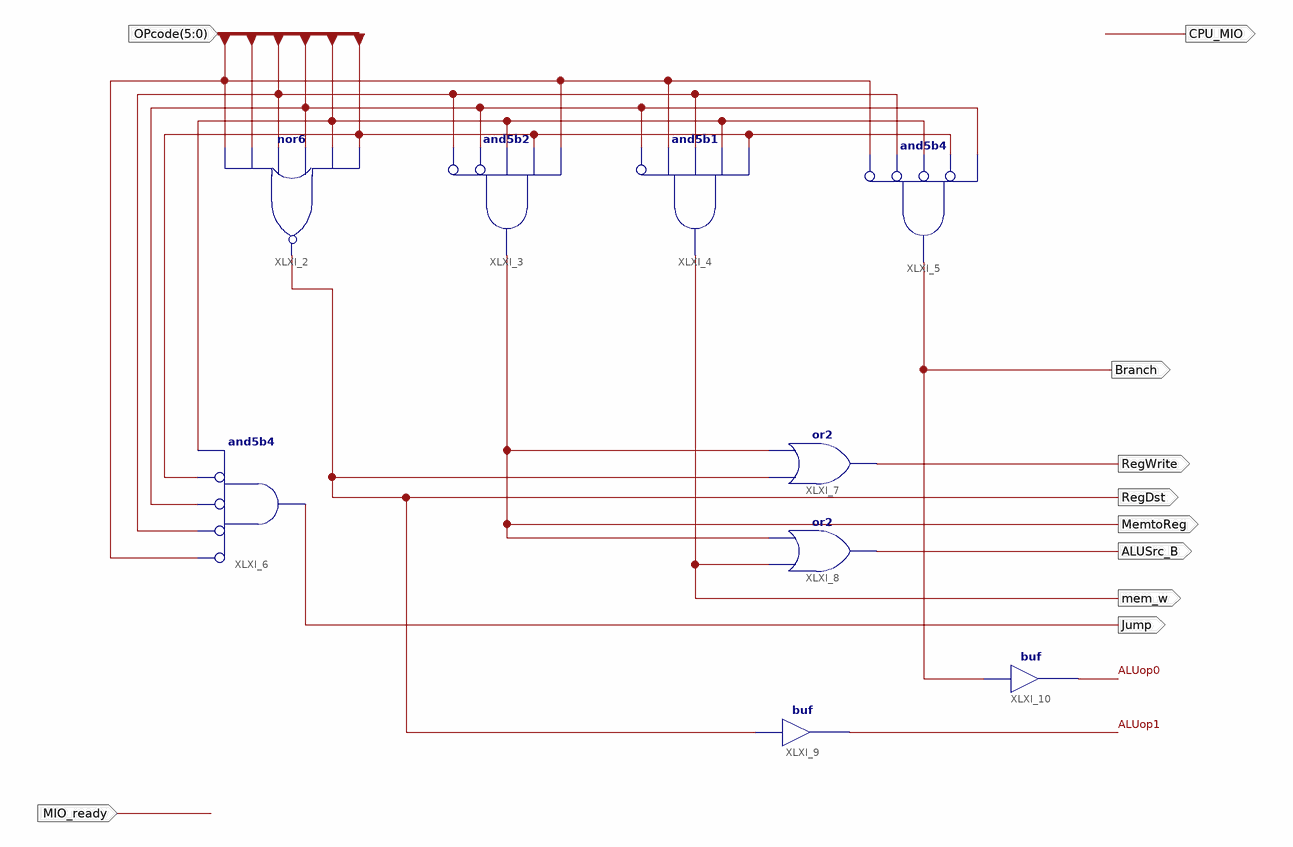
[diagram p0: schematic sheet 1]
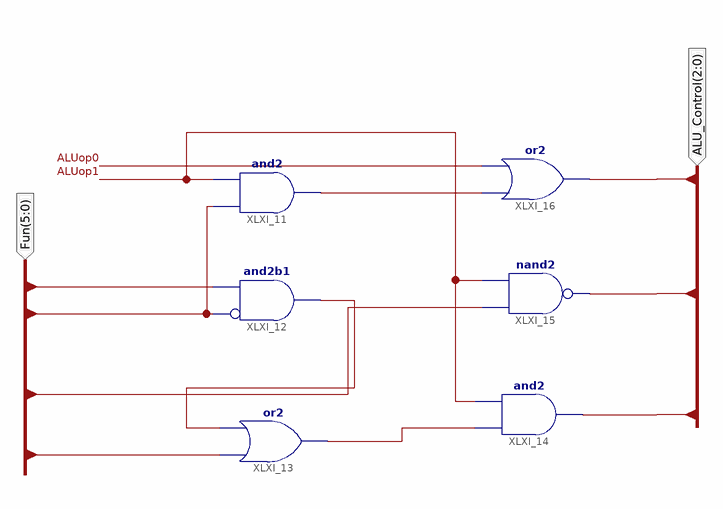
[diagram p1: schematic sheet 2]
// Xilinx ISE schematic SCPU_ctrl.sch (kintex7) as structural Verilog: 15 symbols, 12 ports
module SCPU_ctrl (
  input  [5:0] OPcode,
  input  MIO_ready,
  input  [5:0] Fun,
  input  [2:0] ALU_Control,
  output MemtoReg,
  output mem_w,
  output Jump,
  output RegDst,
  output Branch,
  output ALUSrc_B,
  output RegWrite,
  output CPU_MIO
);

  wire ALUop0, ALUop1, XLXN_49, XLXN_53, XLXN_57;

  nor XLXI_2 (RegDst, OPcode[5], OPcode[4], OPcode[3], OPcode[2], OPcode[1], OPcode[0]);
  and XLXI_3 (MemtoReg, ~OPcode[3], ~OPcode[2], OPcode[1], OPcode[0], OPcode[5]);  // and5b2
  and XLXI_4 (mem_w, ~OPcode[2], OPcode[5], OPcode[3], OPcode[1], OPcode[0]);  // and5b1
  and XLXI_5 (Branch, ~OPcode[5], ~OPcode[3], ~OPcode[1], ~OPcode[0], OPcode[2]);  // and5b4
  and XLXI_6 (Jump, ~OPcode[5], ~OPcode[3], ~OPcode[2], ~OPcode[0], OPcode[1]);  // and5b4
  or XLXI_7 (RegWrite, RegDst, MemtoReg);
  or XLXI_8 (ALUSrc_B, mem_w, MemtoReg);
  buf XLXI_9 (ALUop1, RegDst);
  buf XLXI_10 (ALUop0, Branch);
  and XLXI_11 (XLXN_53, Fun[1], ALUop1);
  and XLXI_12 (XLXN_57, ~Fun[1], Fun[0]);  // and2b1
  or XLXI_13 (XLXN_49, Fun[3], XLXN_57);
  and XLXI_14 (ALU_Control[0], XLXN_49, ALUop1);
  nand XLXI_15 (ALU_Control[1], Fun[2], ALUop1);
  or XLXI_16 (ALU_Control[2], XLXN_53, ALUop0);
endmodule
